# Altium project PCB_CH32V003.PrjPcb
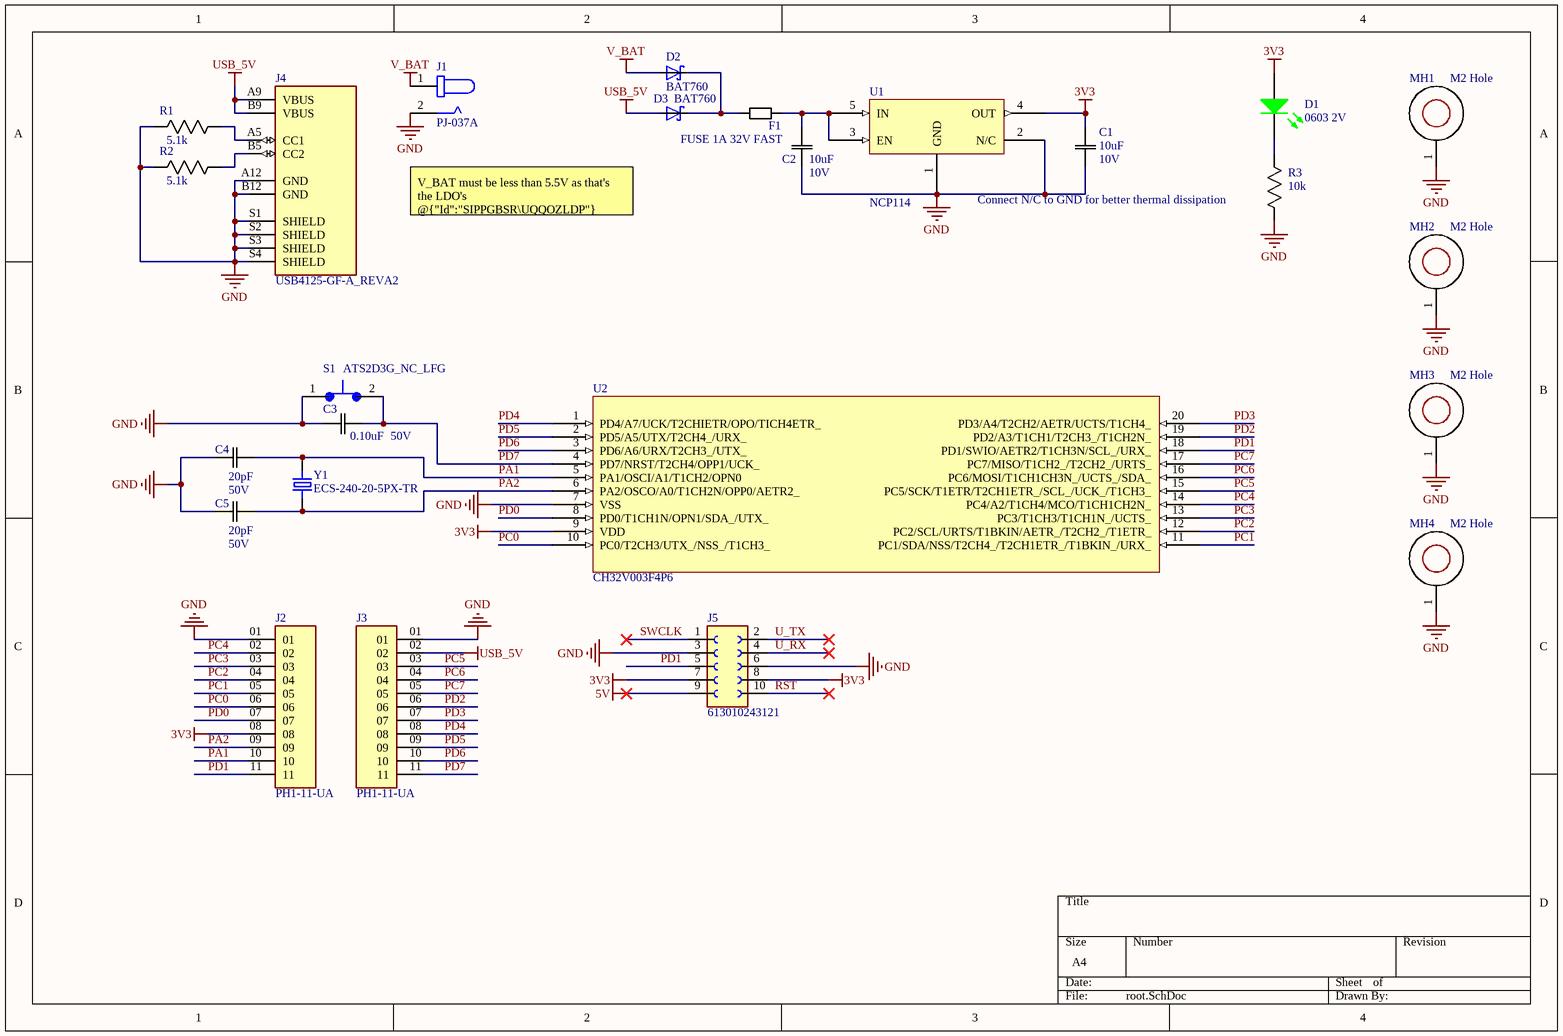
[diagram p0: root.SchDoc]
1 sheet, 25 parts. Net scope: global (net labels, ports and power ports of the same name join across sheets).
Board file: CH32V003_V0.1.PcbDoc

## Sheet root.SchDoc
size A4; SheetNumber: 1; SheetTotal: 1

### Parts
C1  Rating: 10V  [0603]  (hidden comment: 10uF)
C2  Rating: 10V  [0603]  (hidden comment: 10uF)
C3  Rating: 50V  [0603]  (hidden comment: 0.10uF)
C4  (no value)  [0603]
C5  (no value)  [0603]
D1  0603 2V  [0603 - LED]
D2  BAT760  [SOD323(F)]
D3  BAT760  [SOD323(F)]
F1  FUSE 1A 32V FAST  [0603]
J1  PJ-037A  [CUI_PJ-037A]
J2  PH1-11-UA  [11POS 2.54mm Male Header]
J3  PH1-11-UA  [11POS 2.54mm Male Header]
J4  USB4125-GF-A_REVA2  [GCT_USB4125-GF-A_REVA2]
J5  613010243121  [613010243121]
MH1  M2 Hole  [Mounting Hole M2]  (no BOM)
MH2  M2 Hole  [Mounting Hole M2]  (no BOM)
MH3  M2 Hole  [Mounting Hole M2]  (no BOM)
MH4  M2 Hole  [Mounting Hole M2]  (no BOM)
R1  5.1k  [0603]
R2  5.1k  [0603]
R3  10k  [0603]
S1  ATS2D3G_NC_LFG  [SW_ATS2D3G_NC_LFG]
U1  NCP114  [SOT95P295X110-5NW]
U2  CH32V003F4P6  [TSOP65P640X110-20N]
Y1  ECS-240-20-5PX-TR  [XTAL_ECS-240-20-5PX-TR]

### Nets
3V3: C1.2(C2) D1.1(A) J2.08 J5.7 J5.8 U1.4(OUT) U2.9(VDD)
5V: J5.9
GND: C1.1(C1) C2.1(C1) C3.1(C1) C4.1(C1) C5.1(C1) J1.2 J2.01 J3.01 J4.A12(GND) J4.B12(GND) J4.S1(SHIELD) J4.S2(SHIELD) J4.S3(SHIELD) J4.S4(SHIELD) J5.3 J5.6 MH1.1 MH2.1 MH3.1 MH4.1 R1.2(R2) R2.2(R2) R3.1(R1) S1.1 U1.1(GND) U1.2(N/C) U2.7(VSS)
USB_5V: D3.2(A) J3.02 J4.A9(VBUS) J4.B9(VBUS)
V_BAT: D2.2(A) J1.1
PA1: C4.2(C2) J2.10 U2.5(PA1/OSCI/A1/T1CH2/OPN0) Y1.1
PA2: C5.2(C2) J2.09 U2.6(PA2/OSCO/A0/T1CH2N/OPP0/AETR2_) Y1.2
PC0: J2.06 U2.10(PC0/T2CH3/UTX_/NSS_/T1CH3_)
PC1: J2.05 U2.11(PC1/SDA/NSS/T2CH4_/T2CH1ETR_/T1BKIN_/URX_)
PC2: J2.04 U2.12(PC2/SCL/URTS/T1BKIN/AETR_/T2CH2_/T1ETR_)
PC3: J2.03 U2.13(PC3/T1CH3/T1CH1N_/UCTS_)
PC4: J2.02 U2.14(PC4/A2/T1CH4/MCO/T1CH1CH2N_)
PC5: J3.03 U2.15(PC5/SCK/T1ETR/T2CH1ETR_/SCL_/UCK_/T1CH3_)
PC6: J3.04 U2.16(PC6/MOSI/T1CH1CH3N_/UCTS_/SDA_)
PC7: J3.05 U2.17(PC7/MISO/T1CH2_/T2CH2_/URTS_)
PD0: J2.07 U2.8(PD0/T1CH1N/OPN1/SDA_/UTX_)
PD1: J2.11 J5.5 U2.18(PD1/SWIO/AETR2/T1CH3N/SCL_/URX_)
PD2: J3.06 U2.19(PD2/A3/T1CH1/T2CH3_/T1CH2N_)
PD3: J3.07 U2.20(PD3/A4/T2CH2/AETR/UCTS/T1CH4_)
PD4: J3.08 U2.1(PD4/A7/UCK/T2CHIETR/OPO/TICH4ETR_)
PD5: J3.09 U2.2(PD5/A5/UTX/T2CH4_/URX_)
PD6: J3.10 U2.3(PD6/A6/URX/T2CH3_/UTX_)
PD7: C3.2(C2) J3.11 S1.2 U2.4(PD7/NRST/T2CH4/OPP1/UCK_)
RST: J5.10
SWCLK: J5.1
U_RX: J5.4
U_TX: J5.2
NetC2_2: C2.2(C2) F1.2 U1.3(EN) U1.5(IN)
NetD1_2: D1.2(K) R3.2(R2)
NetD2_1: D2.1(K) D3.1(K) F1.1
NetJ4_A5: J4.A5(CC1) R1.1(R1)
NetJ4_B5: J4.B5(CC2) R2.1(R1)

### Notes on the sheet
- V_BAT must be less than 5.5V as that's the LDO's @{"Id":"SIPPGBSR\UQQOZLDP"} maximum input voltage
- (near R3) Connect N/C to GND for better thermal dissipation
- (in symbol CAP 20pF 50V) 20pF; 50V

### Library data of the parts
C1 C2 = CAP 10uF 10V: Default Symbol for Capacitors; Tolerance: 10%; Value: 10uF; Part Number: CAP 10uF 10V
C3 = CAP 0.1uF 50V: Default Symbol for Capacitors; Temperature Coefficient: X7R; Tolerance: 10%; Value: 0.10uF; Part Number: CAP 0.1uF 50V
C4 C5 = CAP 20pF 50V: CAP CER 22pF 50V C0G 0603/0805
D1 = LED GREEN SMD 0603: LED Uni-Color Green 574nm 2-Pin Chip LED T/R; Manufacturer Part Number 1: LTST-C190KGKT; Current Rating: 20mA; Part Number: LED GREEN SMD 0603; Supplier 1: Digi-Key; Supplier Part Number 1: 160-1435-1-ND; Supplier URL 1: https://www.digikey.ca/en/products/detail/lite-on-inc/LTST-C190KGKT/386815?s=N4IgTCBcDaIIwDYAMBaOAWAzAVjSgcgCIgC6AvkA; Pin Count: 2; Voltage Rating - DC: 2V
D2 D3 = BAT760: Diode Schottky 20V 1A _DC_ Surface Mount SOD-323; MF: Nexperia USA; Price: None; Package: SOD-323 NXP Semiconductors; Value: *; MP: BAT760; Availability: Unavailable; SnapEDA_Link: https://www.snapeda.com/parts/BAT760/Nexperia%20USA%20Inc./view-part/182736/?ref=snap
F1 = FUSE 1A 32V FAST: FUSE 1A 32V DC 0603; Response Time: Fast Blow; Current Rating: 1A; ComponentLink1Description: digikey; ComponentLink1URL: https://www.digikey.ca/en/products/detail/kemet/C0603C100K5RAC7867/8572397; Voltage Rating - DC: 32V; Operating Temperature: -55°C ~ 90°C; Part Number: FUSE 1A 32V FAST; Supplier 1: Digi-Key; Supplier URL 1: https://www.digikey.ca/en/products/detail/kemet/C0603C100K5RAC7867/8572397; Pin Count: 2
J1 = PJ-037A: 2.0 mm Center Pin, 2.5 A, Right Angle, Through Hole, Dc Power Jack Connector; Package: None; MP: PJ-037A; Value: *; Availability: Unavailable; Price: None
J2 J3 = PH1-11-UA: 11POS Male Header; MP: TS-111-T-A-1; MF: Samtec; Check_prices: https://www.snapeda.com/parts/TS-111-T-A-1/Samtec/view-part/?ref=eda; Value: *; Availability: In Stock; Price: None; Package: None; SnapEDA_Link: https://www.snapeda.com/parts/TS-111-T-A-1/Samtec/view-part/?ref=snap; Purchase-URL: https://pricing.snapeda.com/search/part/TS-111-T-A-1/?ref=eda
J5 = 613010243121: 10 Position Header Connector Through Hole, Right Angle; MF: Wurth Elektronik; Availability: Good; Check_prices: https://www.snapeda.com/parts/613010243121/W%C3%BCrth%20Elektronik/view-part/5049423/?ref=eda; SnapEDA_Link: https://www.snapeda.com/parts/613010243121/W%C3%BCrth%20Elektronik/view-part/5049423/?ref=snap; Purchase-URL: https://pricing.snapeda.com/search/part/613010243121/?ref=eda; Package: None; MP: 613010243121; Value: *; Price: None
MH1-MH4 = MOUNTING HOLE M2: Standard M2 Mounting Hole for M2 Standoff; Part Number: MOUNTING HOLE M2
R1 R2 = RES 5.1k 1/8W - 1%: Default Resistor Symbol; Power (Watts): 0.125W; Tolerance: 5%; Package: 0805; Value: 5.1k; Part Number: RES 5.1k 1/8W - 1%
R3 = RES 10k 1/8W - 1%: Default Resistor Symbol; Manufacturer Part Number 1: ERJ-H3GJ103V; Power (Watts): 0.125W; Tolerance: 5%; Package: 0805; Value: 10k; Part Number: RES 10k 1/8W - 1%; Supplier 1: Digi-Key; Supplier Part Number 1: 10-ERJ-H3GJ103VCT-ND; Supplier URL 1: https://www.digikey.ca/en/products/detail/panasonic-electronic-components/ERJ-H3GJ103V/13877876?s=N4IgTCBcDaIIwAYC0BRASgKSQCQMwHENFcA1AYQBUkA5AERAF0BfIA; Manufacturer Part Number 2: RMCF0805JT10K0; Supplier 2: Digi-Key; Supplier Part Number 2: RMCF0805JT10K0CT-ND; Supplier URL 2: https://www.digikey.ca/en/products/detail/stackpole-electronics-inc/RMCF0805JT10K0/1757762?s=N4IgTCBcDaIEoFkDCAxADADjQVgFIBUBGNAaTSXxAF0BfIA; Tolerance 2: 5%
S1 = ATS2D3G_NC_LFG: Tactile Switch SPST-NC Top Actuated Surface Mount; Package: None; Price: None; Value: *; MP: ATS2D3G_NC_LFG; Availability: Unavailable
U1 = NCP114: 300 mA LDO that provides the engineer with a very / stable, accurate voltage with low noise suitable for space constrained, noise sensitive applications. In order to optimize performance for battery operated portable applications, the NCP114 employs the dynamic quiescent current adjustment for very low IQ consumption at no−load.
U2 = CH32V003F4P6: Microcontroller designed based on QingKe RISC-V2A / core, which supports 48MHz system main frequency in the product function. The series features wide voltage, / single-wire serial debug interface, low-power consumption and ultra-small package. It provides commonly used / peripheral functions, built-in 1 group of DMA controller, 1 group of 10-bit analog-to-digital conversion ADC, 1 / group of op-amp comparator, multiple timers, standard communication interfaces such as USART, I2C, SPI, etc. / The rated operating voltage of the product is 3.3V or 5V, and the operating temperature range is -40℃～85℃ / industrial- grade.
Y1 = ECS-240-20-5PX-TR: 24 MHz Â±30ppm Crystal 20pF 30 Ohms HC-49/US; MF: ECS Inc.; Package: HC49/US ECS International; Digi-Key_Part_Number: XC1255TR-ND; Purchase-URL: https://pricing.snapeda.com/search/part/ECS-240-20-5PX-TR/?ref=eda; Value: *; SnapEDA_Link: https://www.snapeda.com/parts/ECS-240-20-5PX-TR/ECS+Inc./view-part/?ref=snap; Check_prices: https://www.snapeda.com/parts/ECS-240-20-5PX-TR/ECS+Inc./view-part/?ref=eda; MP: ECS-240-20-5PX-TR
J4 = USB4125-GF-A_REVA2: Package: None; Availability: Unavailable; MP: USB4125-GF-A_REVA2; Value: *; Price: None